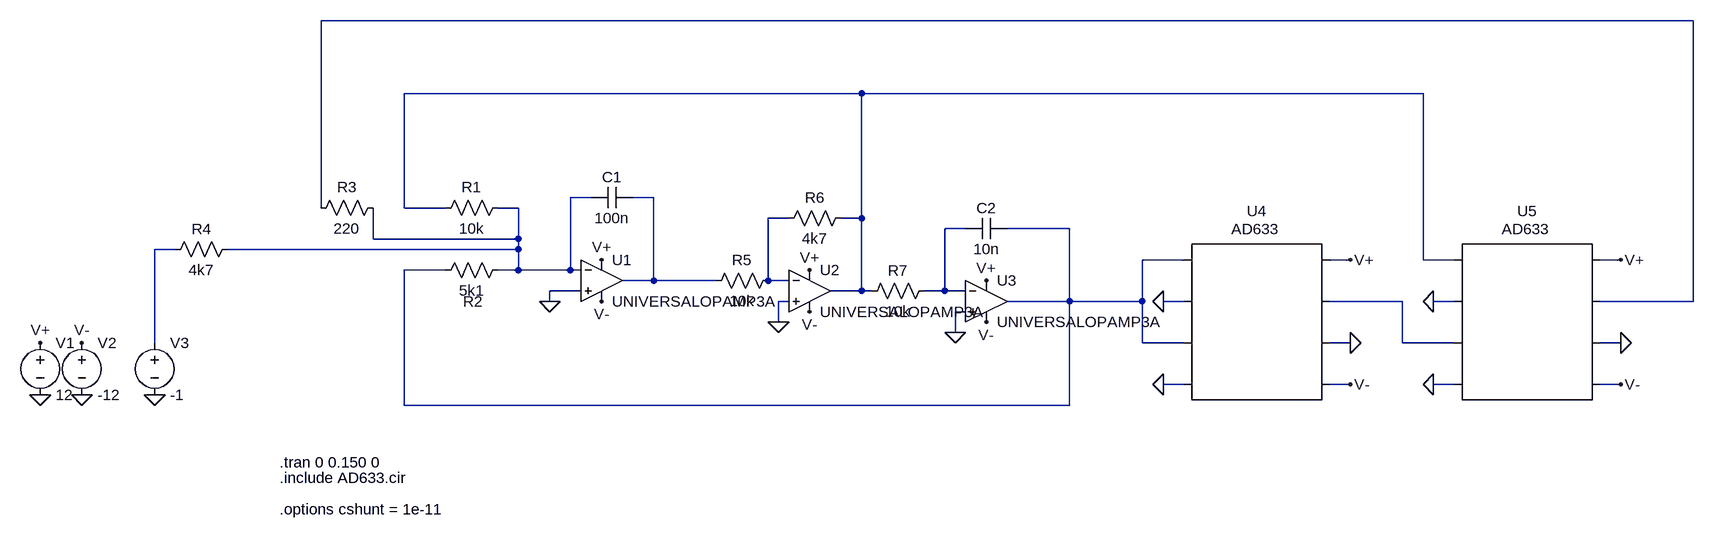
[diagram p0: schematic VdPsim.asc]
VdPsim.asc, the LTspice schematic file:
Version 4
SHEET 1 1908 696
WIRE 1904 -96 -208 -96
WIRE 624 16 -80 16
WIRE 1488 16 624 16
WIRE 208 176 176 176
WIRE 304 176 272 176
WIRE -208 192 -208 -96
WIRE -80 192 -80 16
WIRE -16 192 -80 192
WIRE 96 192 64 192
WIRE 512 208 480 208
WIRE 624 208 624 16
WIRE 624 208 592 208
WIRE 784 224 752 224
WIRE 944 224 848 224
WIRE -128 240 -128 192
WIRE 96 240 96 192
WIRE 96 240 -128 240
WIRE -432 256 -464 256
WIRE 96 256 96 240
WIRE 96 256 -352 256
WIRE 1120 272 1056 272
WIRE 1376 272 1344 272
WIRE 1488 272 1488 16
WIRE 1536 272 1488 272
WIRE 1792 272 1760 272
WIRE -16 288 -80 288
WIRE 96 288 96 256
WIRE 96 288 64 288
WIRE 176 288 176 176
WIRE 176 288 96 288
WIRE 192 288 176 288
WIRE 304 304 304 176
WIRE 304 304 256 304
WIRE 400 304 304 304
WIRE 480 304 480 208
WIRE 512 304 480 304
WIRE 192 320 144 320
WIRE 624 320 624 208
WIRE 624 320 576 320
WIRE 640 320 624 320
WIRE 752 320 752 224
WIRE 752 320 720 320
WIRE 784 320 752 320
WIRE 144 336 144 320
WIRE 512 336 496 336
WIRE 944 336 944 224
WIRE 944 336 848 336
WIRE 1056 336 1056 272
WIRE 1056 336 944 336
WIRE 1120 336 1088 336
WIRE 1456 336 1344 336
WIRE 1536 336 1504 336
WIRE 1904 336 1904 -96
WIRE 1904 336 1760 336
WIRE 784 352 768 352
WIRE 496 368 496 336
WIRE 768 384 768 352
WIRE -464 400 -464 256
WIRE 1056 400 1056 336
WIRE 1120 400 1056 400
WIRE 1376 400 1344 400
WIRE 1456 400 1456 336
WIRE 1536 400 1456 400
WIRE 1792 400 1760 400
WIRE 1120 464 1088 464
WIRE 1376 464 1344 464
WIRE 1536 464 1504 464
WIRE 1792 464 1760 464
WIRE -80 496 -80 288
WIRE 944 496 944 336
WIRE 944 496 -80 496
FLAG 144 336 0
FLAG -640 480 0
FLAG -576 480 0
FLAG -640 400 V+
FLAG 224 272 V+
FLAG -576 400 V-
FLAG 224 336 V-
FLAG 544 288 V+
FLAG 544 352 V-
FLAG 816 304 V+
FLAG 816 368 V-
FLAG -464 480 0
FLAG 496 368 0
FLAG 768 384 0
FLAG 1088 336 0
FLAG 1088 464 0
FLAG 1376 464 V-
FLAG 1376 272 V+
FLAG 1792 464 V-
FLAG 1792 272 V+
FLAG 1504 336 0
FLAG 1504 464 0
FLAG 1376 400 0
FLAG 1792 400 0
SYMBOL res 80 176 R90
WINDOW 0 0 56 VBottom 2
WINDOW 3 32 56 VTop 2
SYMATTR InstName R1
SYMATTR Value 10k
SYMBOL res 80 272 R90
WINDOW 0 80 54 VBottom 2
WINDOW 3 32 56 VTop 2
SYMATTR InstName R2
SYMATTR Value 5k1
SYMBOL cap 272 160 R90
WINDOW 0 0 32 VBottom 2
WINDOW 3 32 32 VTop 2
SYMATTR InstName C1
SYMATTR Value 100n
SYMBOL res 496 288 R90
WINDOW 0 0 56 VBottom 2
WINDOW 3 32 56 VTop 2
SYMATTR InstName R5
SYMATTR Value 10k
SYMBOL res 608 192 R90
WINDOW 0 0 56 VBottom 2
WINDOW 3 32 56 VTop 2
SYMATTR InstName R6
SYMATTR Value 4k7
SYMBOL res 736 304 R90
WINDOW 0 0 56 VBottom 2
WINDOW 3 32 56 VTop 2
SYMATTR InstName R7
SYMATTR Value 10k
SYMBOL cap 848 208 R90
WINDOW 0 0 32 VBottom 2
WINDOW 3 32 32 VTop 2
SYMATTR InstName C2
SYMATTR Value 10n
SYMBOL voltage -640 384 R0
WINDOW 123 0 0 Left 0
WINDOW 39 0 0 Left 0
SYMATTR InstName V1
SYMATTR Value 12
SYMBOL voltage -576 384 R0
WINDOW 123 0 0 Left 0
WINDOW 39 0 0 Left 0
SYMATTR InstName V2
SYMATTR Value -12
SYMBOL voltage -464 384 R0
WINDOW 123 0 0 Left 0
WINDOW 39 0 0 Left 0
SYMATTR InstName V3
SYMATTR Value -1
SYMBOL res -112 176 R90
WINDOW 0 0 56 VBottom 2
WINDOW 3 32 56 VTop 2
SYMATTR InstName R3
SYMATTR Value 220
SYMBOL Misc\\DIP8 1232 368 R0
WINDOW 38 -2 -143 Center 2
WINDOW 0 0 -171 Center 2
SYMATTR SpiceModel AD633
SYMATTR InstName U4
SYMBOL res -336 240 R90
WINDOW 0 0 56 VBottom 2
WINDOW 3 32 56 VTop 2
SYMATTR InstName R4
SYMATTR Value 4k7
SYMBOL OpAmps\\UniversalOpAmp3a 224 304 R0
SYMATTR InstName U1
SYMBOL OpAmps\\UniversalOpAmp3a 544 320 R0
SYMATTR InstName U2
SYMBOL OpAmps\\UniversalOpAmp3a 816 336 R0
SYMATTR InstName U3
SYMBOL Misc\\DIP8 1648 368 R0
WINDOW 38 -2 -143 Center 2
WINDOW 0 0 -171 Center 2
SYMATTR SpiceModel AD633
SYMATTR InstName U5
TEXT -272 584 Left 2 !.tran 0 0.150 0
TEXT -272 608 Left 2 !.include AD633.cir
TEXT -272 656 Left 2 !.options cshunt = 1e-11

The netlist it stands for:
* VdPsim.asc
R1 N003 N002 10k
R2 N003 N007 5k1
C1 N004 N003 100n
R5 N005 N004 10k
R6 N002 N005 4k7
R7 N006 N002 10k
C2 N007 N006 10n
V1 V+ 0 12
V2 V- 0 -12
V3 N008 0 -1
R3 N003 N001 220
XU4 N007 0 N007 0 V- 0 N009 V+ AD633
R4 N003 N008 4k7
XU1 0 N003 V+ V- N004 level3a Avol=1Meg GBW=10Meg Slew=10Meg Ilimit=25m Rail=0 Vos=0 Phimargin=45 En=0 Enk=0 In=0 Ink=0 Rin=500Meg  ; UNIVERSALOPAMP3A, pins In+ In- V+ V- OUT
XU2 0 N005 V+ V- N002 level3a Avol=1Meg GBW=10Meg Slew=10Meg Ilimit=25m Rail=0 Vos=0 Phimargin=45 En=0 Enk=0 In=0 Ink=0 Rin=500Meg  ; UNIVERSALOPAMP3A, pins In+ In- V+ V- OUT
XU3 0 N006 V+ V- N007 level3a Avol=1Meg GBW=10Meg Slew=10Meg Ilimit=25m Rail=0 Vos=0 Phimargin=45 En=0 Enk=0 In=0 Ink=0 Rin=500Meg  ; UNIVERSALOPAMP3A, pins In+ In- V+ V- OUT
XU5 N002 0 N009 0 V- 0 N001 V+ AD633
.tran 0 0.150 0
.include AD633.cir
.options cshunt = 1e-11
.backanno
.end